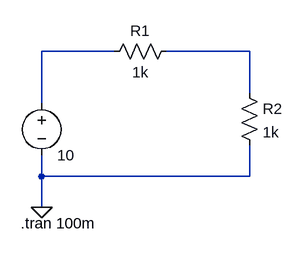
[diagram p0: schematic Simple Resistive Voltage Divider.asc]
Simple Resistive Voltage Divider.asc, the LTspice schematic file:
Version 4.1
SHEET 1 880 680
WIRE 112 80 0 80
WIRE 320 80 192 80
WIRE 320 144 320 80
WIRE 0 160 0 80
WIRE 0 272 0 240
WIRE 320 272 320 224
WIRE 320 272 0 272
WIRE 0 320 0 272
FLAG 0 320 0
SYMBOL res 208 64 R90
WINDOW 0 0 56 VBottom 2
WINDOW 3 32 56 VTop 2
SYMATTR InstName R1
SYMATTR Value 1k
SYMBOL res 304 128 R0
SYMATTR InstName R2
SYMATTR Value 1k
SYMBOL voltage 0 144 R0
WINDOW 0 38 16 Invisible 2
WINDOW 123 0 0 Left 0
WINDOW 39 0 0 Left 0
SYMATTR InstName V
SYMATTR Value 10
TEXT -32 344 Left 2 !.tran 100m

The netlist it stands for:
* Simple Resistive Voltage Divider.asc
R1 N002 N001 1k
R2 N002 0 1k
V N001 0 10
.tran 100m
.backanno
.end